# Altium schematic sheet power_hall_crossboard_1_1.SchDoc
size A3
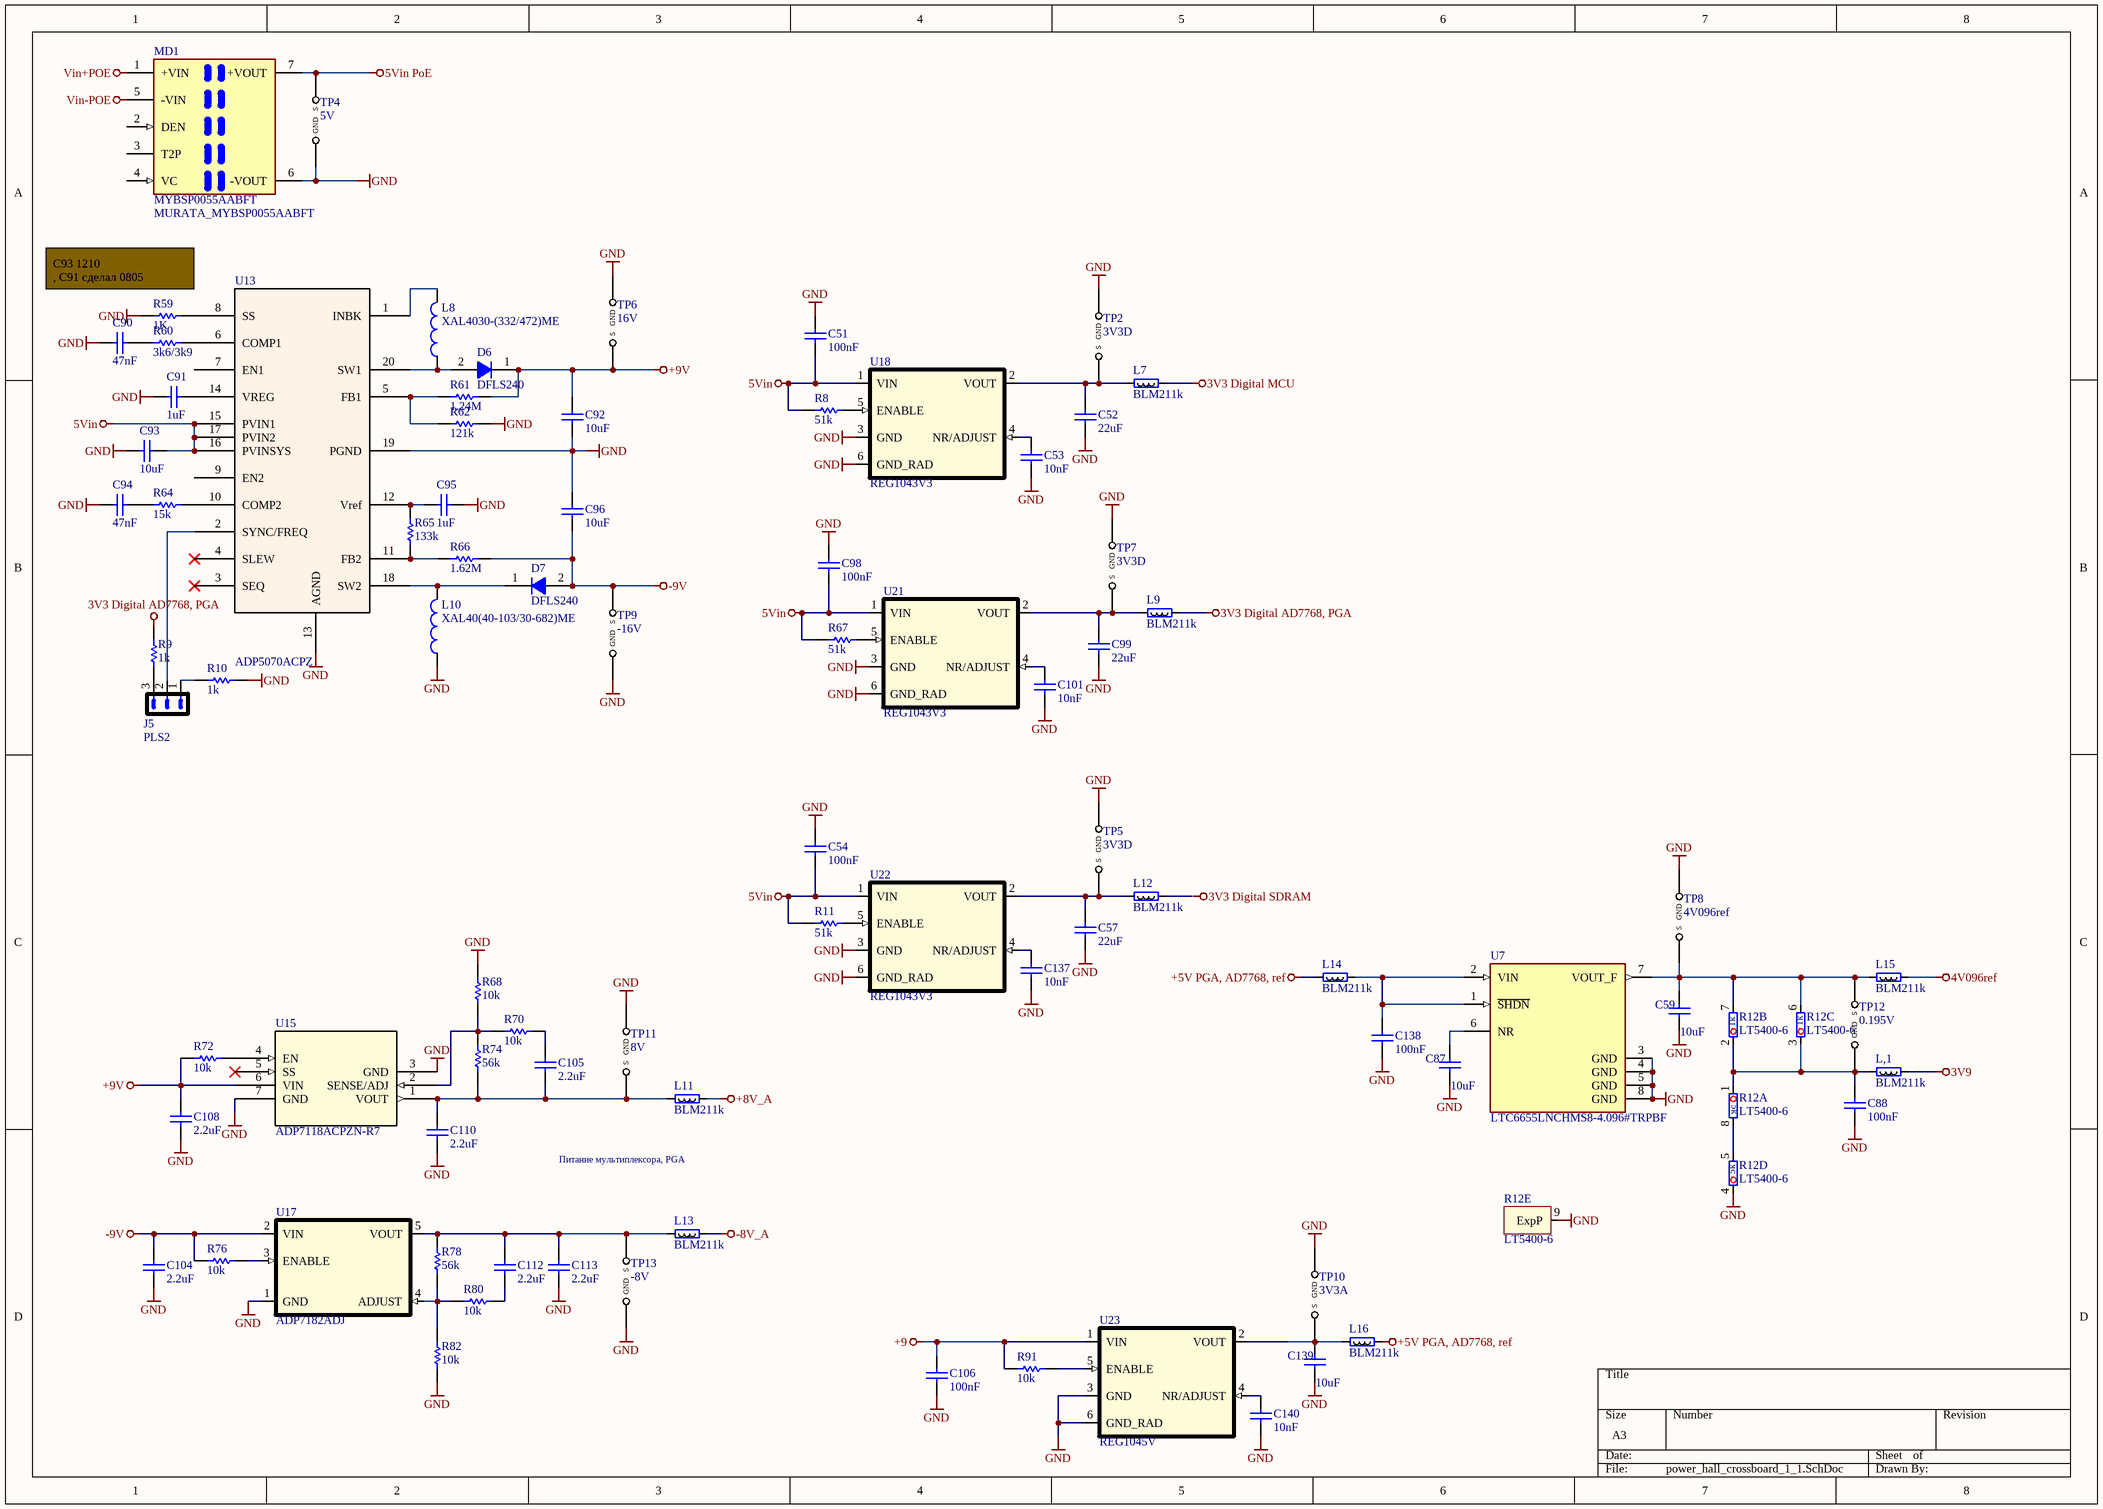
[diagram p0: power_hall_crossboard_1_1.SchDoc]

## Parts
C51  100nF  [0603C]
C52  22uF  [0805C]
C53  10nF  [0603C]
C54  100nF  [0603C]
C57  22uF  [0805C]
C59  10uF  [0805C]
C87  10uF  [0805C]
C88  100nF  [0603C]
C90  47nF  [0603C]
C91  1uF  [0805C]
C92  10uF  [0805C]
C93  10uF  [0805C]
C94  47nF  [0603C]
C95  1uF  [0805C]
C96  10uF  [0805C]
C98  100nF  [0603C]
C99  22uF  [0805C]
C101  10nF  [0603C]
C104  2.2uF  [0805C]
C105  2.2uF  [0805C]
C106  100nF  [0603C]
C108  2.2uF  [0805C]
C110  2.2uF  [0805C]
C112  2.2uF  [0805C]
C113  2.2uF  [0805C]
C137  10nF  [0603C]
C138  100nF  [0603C]
C139  10uF  [0805C]
C140  10nF  [0603C]
D6  DFLS240  [DFLS240]
D7  DFLS240  [DFLS240]
J5  PLS2  [COMATEL_385.0358.1.03.400]
L7  BLM211k  [RESC2012X50N]
L8  XAL4030-(332/472)ME  [XAL40]
L9  BLM211k  [RESC2012X50N]
L10  XAL40(40-103/30-682)ME  [XAL40]
L11  BLM211k  [RESC2012X50N]
L12  BLM211k  [RESC2012X50N]
L13  BLM211k  [RESC2012X50N]
L14  BLM211k  [RESC2012X50N]
L15  BLM211k  [RESC2012X50N]
L16  BLM211k  [RESC2012X50N]
L,1  BLM211k  [RESC2012X50N]
MD1  MURATA_MYBSP0055AABFT  [MURATA_MYBSP0055AABFT_0]
R8  51k  [0603R]
R9  1k  [0603R]
R10  1k  [0603R]
R11  51k  [0603R]
R12  LT5400-6  [SOP65P488X110-9N-R178X241]  (parts A,B,C,D,E of 5)
R59  1K  [0603R]
R60  3k6/3k9  [0603R]
R61  1.24M  [0603R]
R62  121k  [0603R]
R64  15k  [0603R]
R65  133k  [0603R]
R66  1.62M  [0603R]
R67  51k  [0603R]
R68  10k  [0603R]
R70  10k  [0603R]
R72  10k  [0603R]
R74  56k  [0603R]
R76  10k  [0603R]
R78  56k  [0603R]
R80  10k  [0603R]
R82  10k  [0603R]
R91  10k  [0603R]
TP2  3V3D  [TP2]
TP4  5V  [TP2]
TP5  3V3D  [TP2]
TP6  16V  [TP2]
TP7  3V3D  [TP2]
TP8  4V096ref  [TP2]
TP9  -16V  [TP2]
TP10  3V3A  [TP2]
TP11  8V  [TP2]
TP12  0.195V  [TP2]
TP13  -8V  [TP2]
U7  LTC6655LNCHMS8-4.096#TRPBF  [SOP65P490X110-8N]
U13  ADP5070ACPZ  [QFN50P400X400X100-21N-S265]
U15  ADP7118ACPZN-R7  [CP-6-3_ADI-M]
U17  ADP7182ADJ  [SOT23-5]
U18  REG1043V3  [SOT223_6-127]
U21  REG1043V3  [SOT223_6-127]
U22  REG1043V3  [SOT223_6-127]
U23  REG1045V  [SOT223_6-127]

## Nets
3V3 Digital AD7768, PGA: L9.2 R9.1
3V3 Digital MCU: L7.2
3V9: L,1.2
4V096ref: L15.2
5Vin: C51.1 C54.1 C93.2 C98.1 R8.1 R11.1 R67.1 U13.15(PVIN1) U13.16(PVINSYS) U13.17(PVIN2) U18.1(VIN) U21.1(VIN) U22.1(VIN)
5Vin PoE: MD1.7(+VOUT) TP4.1(S)
+5V PGA, AD7768, ref: L14.1 L16.2
+8V_A: L11.2
+9: C106.1 R91.1 U23.1(VIN)
+9V: C92.2 C108.2 D6.1(K) R61.2 R72.1 TP6.1(S) U15.6(VIN)
-8V_A: L13.2
-9V: C96.1 C104.2 D7.2(A) R66.2 R76.1 TP9.1(S) U17.2(VIN)
GND: C51.2 C52.1 C53.1 C54.2 C57.1 C59.1 C87.1 C88.1 C90.1 C91.1 C92.1 C93.1 C94.1 C95.1 C96.2 C98.2 C99.1 C101.1 C104.1 C106.2 C108.1 C110.1 C113.1 C137.1 C138.1 C139.1 C140.1 L10.1 MD1.6(-VOUT) R10.1 R12.4 R12.9(ExpP) R59.1 R62.2 R68.1 R82.2 TP2.2(GND) TP4.2(GND) TP5.2(GND) TP6.2(GND) TP7.2(GND) TP8.2(GND) TP9.2(GND) TP10.2(GND) TP11.2(GND) TP13.2(GND) U7.3(GND) U7.4(GND) U7.5(GND) U7.8(GND) U13.13(AGND) U13.19(PGND) U15.3(GND) U15.7(GND) U17.1(GND) U18.3(GND) U18.6(GND_RAD) U21.3(GND) U21.6(GND_RAD) U22.3(GND) U22.6(GND_RAD) U23.3(GND) U23.6(GND_RAD)
Vin+POE: MD1.1(+VIN)
Vin-POE: MD1.5(-VIN)
NetC52_2: C52.2 L7.1 TP2.1(S) U18.2(VOUT)
NetC53_2: C53.2 U18.4(NR/ADJUST)
NetC57_2: C57.2 L12.1 TP5.1(S) U22.2(VOUT)
NetC59_2: C59.2 L15.1 R12.6 R12.7 TP8.1(S) TP12.1(S) U7.7(VOUT_F)
NetC87_2: C87.2 U7.6(NR)
NetC88_2: C88.2 L,1.1 R12.1 R12.2 R12.3 TP12.2(GND)
NetC90_2: C90.2 R60.1
NetC91_2: C91.2 U13.14(VREG)
NetC94_2: C94.2 R64.1
NetC95_2: C95.2 R65.2 U13.12(Vref)
NetC99_2: C99.2 L9.1 TP7.1(S) U21.2(VOUT)
NetC101_2: C101.2 U21.4(NR/ADJUST)
NetC105_1: C105.1 C110.2 L11.1 R74.2 TP11.1(S) U15.1(VOUT)
NetC105_2: C105.2 R70.2
NetC112_1: C112.1 R80.2
NetC112_2: C112.2 C113.2 L13.1 R78.1 TP13.1(S) U17.5(VOUT)
NetC137_2: C137.2 U22.4(NR/ADJUST)
NetC138_2: C138.2 L14.2 U7.1(~{SHDN}) U7.2(VIN)
NetC139_2: C139.2 L16.1 TP10.1(S) U23.2(VOUT)
NetC140_2: C140.2 U23.4(NR/ADJUST)
NetD6_2: D6.2(A) L8.1 U13.20(SW1)
NetD7_1: D7.1(K) L10.2 U13.18(SW2)
NetJ5_1: J5.1 R10.2
NetJ5_2: J5.2 U13.2(SYNC/FREQ)
NetJ5_3: J5.3 R9.2
NetL8_2: L8.2 U13.1(INBK)
NetR8_2: R8.2 U18.5(ENABLE)
NetR11_2: R11.2 U22.5(ENABLE)
NetR12_5: R12.5 R12.8
NetR59_2: R59.2 U13.8(SS)
NetR60_2: R60.2 U13.6(COMP1)
NetR61_1: R61.1 R62.1 U13.5(FB1)
NetR64_2: R64.2 U13.10(COMP2)
NetR65_1: R65.1 R66.1 U13.11(FB2)
NetR67_2: R67.2 U21.5(ENABLE)
NetR68_2: R68.2 R70.1 R74.1 U15.2(SENSE/ADJ)
NetR72_2: R72.2 U15.4(EN)
NetR76_2: R76.2 U17.3(ENABLE)
NetR78_2: R78.2 R80.1 R82.1 U17.4(ADJUST)
NetR91_2: R91.2 U23.5(ENABLE)

Not connected (* = marked no-connect by the designer): L12 2; MD1 2(DEN) 3(T2P) 4(VC); U13 3(SEQ)* 4(SLEW)* 7(EN1) 9(EN2); U15 5(SS)*

## Notes on the sheet
- (near R59) C93 1210
  , C91 сделал 0805
- Питание мультиплексора, PGA
- Labels drawn without touching a wire or pin: 3V3 Digital SDRAM
- (in symbol LT5400, part A) 5k
- (in symbol LT5400, part B) 1k
- (in symbol LT5400, part C) 1k
- (in symbol LT5400, part D) 5k

## Library data of the parts
C51-C54 C57 C88 C90-C96 C98 C99 C101 C104-C106 C108 C110 C112 C113 C137 C138 C140 = Capacitor_ST: Capacitor 0402 / 0603 / 0805; Revision: July-2002: Re-released for DXP Platform.
  C51 C54 C88 C98 C106 C138: Value: 100nF
  C52 C57 C99: Value: 22uF
  C53 C101 C137 C140: Value: 10nF
  C90 C94: Value: 47nF
  C91 C95: Value: 1uF
  C92 C93 C96: Value: 10uF
  C104 C105 C108 C110 C112 C113: Value: 2.2uF
C59 C87 C139 = Capacitor_ST: Value: 10uF
D6 D7 = DFLS240: 2.0A SURFACE MOUNT SCHOTTKY BARRIER RECTIFIER
J5 = PLS3: Vendor: Confly; SMD Solders: 0; Solder Option: RM; THD Solders: 2; Price: 1; Device: PLS2
L7 L9 L11-L16 L,1 = BLM21: SMD Ferrite bead 0805; Vendor: Vishay; Value: 1k; Pkg: SMD0805; SMD Solders: 2; Solder Option: RM; Device: BLM21; Price: 10
L8 = XAL40: Fixed Inductors 3.3/4.7uH Shld 20% 3.1A 92.4mOhms AECQ2; MF: Coilcraft; MP: XAL4040103ME; SnapEDA_Link: https://www.snapeda.com/parts/XAL4040103ME/Coilcraft/view-part/?ref=snap; Package: None; Value: 30-(332/472)ME; Check_prices: https://www.snapeda.com/parts/XAL4040103ME/Coilcraft/view-part/?ref=eda
L10 = XAL40: Fixed Inductors 6.8/10uH Shld 20% 3.1A 92.4mOhms AECQ2; MF: Coilcraft; MP: XAL4040103ME; SnapEDA_Link: https://www.snapeda.com/parts/XAL4040103ME/Coilcraft/view-part/?ref=snap; Package: None; Value: (40-103/30-682)ME; Check_prices: https://www.snapeda.com/parts/XAL4040103ME/Coilcraft/view-part/?ref=eda
MD1 = MURATA_MYBSP0055AABFT: Isolated PoE Module DC DC Converter 1 Output 5V - - - 5.1A 37V - 57V Input; MF: Murata Power Solutions Inc.; Package: SMD-7 Murata Power Solutions Inc.; Price: None; Check_prices: https://www.snapeda.com/parts/MYBSP0055AABFT/Murata/view-part/?ref=eda; Value: *; SnapEDA_Link: https://www.snapeda.com/parts/MYBSP0055AABFT/Murata/view-part/?ref=snap; MP: MYBSP0055AABFT; Availability: In Stock; Purchase-URL: https://pricing.snapeda.com/search/part/MYBSP0055AABFT/?ref=eda
R8-R11 R59-R62 R65-R68 R70 R72 R76 R80 R82 R91 = Resistor_ST: Resistor 0402 / 0603 / 0805
  R8 R11 R67: Value: 51k
  R9 R10: Value: 1k
  R59: Value: 1K
  R60: Value: 3k6/3k9
  R61: Value: 1.24M
  R62: Value: 121k
  R65: Value: 133k
  R66: Value: 1.62M
  R68 R70 R72 R76 R80 R82 R91: Value: 10k
R12 = LT5400: 4 прецизионных резистора; Vendor: Analog Devices; SMD Solders: 0; Solder Option: i; TC: 200ppb/C; Tolerance: 0..025%; Pkg: MSOP 9-0.65; Pwr: 40C/W; Name to order: LT5400BMPMS8E-6#PBF; Value: -6; Price: 2; Device: LT5400; THD Solders: 0
R64 = Resistor_ST: Resistor 0402 / 0603 / 0805 c2; Value: 15k
R74 R78 = Resistor_ST: Resistor; Ordered by: Subcon; Published: 8-Jun-2000; Revision: July-2002: Re-released for DXP Platform.; Publisher: Altium Limited; Value: 56k
TP2 TP5 TP7 TP10 = OscTP: Контрольная точка для подключения осциллографа короткой землёй; Vendor: PCB; Step: 2; Price: 0; SolderOption: PCB
  TP2 TP5 TP7: Value: 3V3D
  TP10: Value: 3V3A
TP4 TP6 TP8 TP9 TP11-TP13 = OscTP: Контрольная точка для подключения осциллографа короткой землёй; Vendor: PCB; Price: 0; SolderOption: PCB
  TP4: Value: 5V
  TP6: Value: 16V
  TP8: Value: 4V096ref
  TP9: Value: -16V
  TP11: Value: 8V
  TP12: Value: 0.195V
  TP13: Value: -8V
U7 = LTC6655LNCHMS8-4.096#TRPBF: 0.25ppm Noise, Low Drift Precision References; MF: Analog Devices; SnapEDA_Link: https://www.snapeda.com/parts/LTC6655LNCHMS8-4.096%23TRPBF/Analog+Devices/view-part/?ref=snap; Package: MSOP-8 Analog Devices; Value: *; MP: LTC6655LNCHMS8-4.096#TRPBF; Check_prices: https://www.snapeda.com/parts/LTC6655LNCHMS8-4.096%23TRPBF/Analog+Devices/view-part/?ref=eda
U13 = ADP5070ACPZ: 1 A/0.6 A, DC-to-DC Switching Regulator with / Independent Positive and Negative Outputs
U15 = ADP7118ACPZN-R7: No Description Available; Mfr_Name: Analog Devices Inc; Type: Power Management; RefDes: RefDes
U17 = ADP7182: Negative LDO Linear stabilizer; Vendor: Analog Devoces; Value: ADJ; SMD Solders: 5; Solder Option: RM; Name to order: ADP7182AUJZ-R7; Vref: 1V22; Pkg: SOT23-5; Price: 100; Device: ADP7182
U18 U21 U22 = REG104_5V: Positive LDO Linear stabilizer 5Vin to 3V3Digital; Vendor: Texas Instruments; Device: REG104; Value: 3V3; SMD Solder: 6; THD Solder: 0; Step: 2; Unit Price: 6; Package: SOT223-6; SolderOption: 0
U23 = REG104_5V: Positive LDO Linear stabilizer 5Vin to 3V3Digital; Vendor: Texas Instruments; Device: REG104; Value: 5V; SMD Solder: 6; THD Solder: 0; Step: 2; Unit Price: 6; Package: SOT223-6; SolderOption: 0